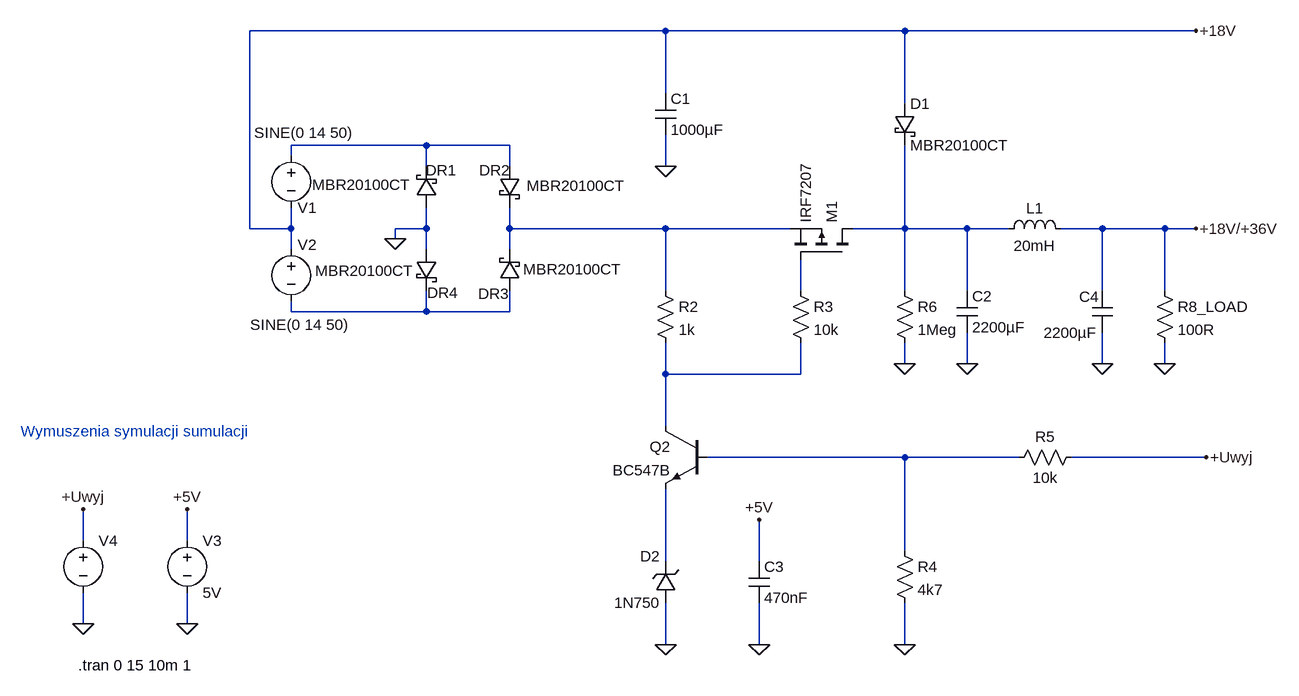
[diagram p0: schematic Base_On_SN1500-APO.asc]
Base_On_SN1500-APO.asc, the LTspice schematic file:
Version 4
SHEET 1 2132 1104
WIRE 768 -112 128 -112
WIRE 1136 -112 768 -112
WIRE 1584 -112 1136 -112
WIRE 768 -16 768 -112
WIRE 1136 0 1136 -112
WIRE 400 64 192 64
WIRE 528 64 400 64
WIRE 192 80 192 64
WIRE 400 96 400 64
WIRE 528 96 528 64
WIRE 768 96 768 48
WIRE 128 192 128 -112
WIRE 192 192 192 160
WIRE 192 192 128 192
WIRE 400 192 400 160
WIRE 400 192 352 192
WIRE 528 192 528 160
WIRE 768 192 528 192
WIRE 960 192 768 192
WIRE 1136 192 1136 64
WIRE 1136 192 1056 192
WIRE 1232 192 1136 192
WIRE 1296 192 1232 192
WIRE 1440 192 1376 192
WIRE 1536 192 1440 192
WIRE 1584 192 1536 192
WIRE 352 208 352 192
WIRE 192 224 192 192
WIRE 400 224 400 192
WIRE 528 224 528 192
WIRE 768 288 768 192
WIRE 976 288 976 240
WIRE 1136 288 1136 192
WIRE 1232 288 1232 192
WIRE 1440 288 1440 192
WIRE 1536 288 1536 192
WIRE 192 320 192 304
WIRE 400 320 400 288
WIRE 400 320 192 320
WIRE 528 320 528 288
WIRE 528 320 400 320
WIRE 1136 400 1136 368
WIRE 1232 400 1232 352
WIRE 1440 400 1440 352
WIRE 1536 400 1536 368
WIRE 768 416 768 368
WIRE 976 416 976 368
WIRE 976 416 768 416
WIRE 768 496 768 416
WIRE 1136 544 832 544
WIRE 1312 544 1136 544
WIRE 1600 544 1392 544
WIRE -128 672 -128 624
WIRE 32 672 32 624
WIRE 1136 688 1136 544
WIRE 768 704 768 592
WIRE 912 704 912 640
WIRE -128 800 -128 752
WIRE 32 800 32 752
WIRE 768 832 768 768
WIRE 912 832 912 768
WIRE 1136 832 1136 768
FLAG 352 208 0
FLAG 768 96 0
FLAG 1584 -112 +18V
FLAG 1136 832 0
FLAG 912 832 0
FLAG 1584 192 +18V/+36V
FLAG 1600 544 +Uwyj
FLAG 1232 400 0
FLAG 32 800 0
FLAG 32 624 +5V
FLAG -128 800 0
FLAG -128 624 +Uwyj
FLAG 1536 400 0
FLAG 1440 400 0
FLAG 768 832 0
FLAG 912 640 +5V
FLAG 1136 400 0
SYMBOL schottky 416 160 R180
WINDOW 0 -31 58 Left 0
WINDOW 3 39 35 Left 0
SYMATTR InstName DR1
SYMATTR Value MBR20100CT
SYMATTR Description Diode
SYMATTR Type diode
SYMBOL schottky 512 96 R0
WINDOW 0 -31 6 Left 0
WINDOW 3 42 30 Left 0
SYMATTR InstName DR2
SYMATTR Value MBR20100CT
SYMATTR Description Diode
SYMATTR Type diode
SYMBOL schottky 544 288 R180
WINDOW 0 16 -4 Left 0
WINDOW 3 -158 33 Left 0
SYMATTR InstName DR3
SYMATTR Value MBR20100CT
SYMATTR Description Diode
SYMATTR Type diode
SYMBOL schottky 384 224 R0
WINDOW 0 17 67 Left 0
WINDOW 3 -155 33 Left 0
SYMATTR InstName DR4
SYMATTR Value MBR20100CT
SYMATTR Description Diode
SYMATTR Type diode
SYMBOL voltage 192 64 R0
WINDOW 0 10 96 Left 0
WINDOW 3 -57 -19 Left 0
WINDOW 123 0 0 Left 0
WINDOW 39 0 0 Left 0
SYMATTR InstName V1
SYMATTR Value SINE(0 14 50)
SYMBOL voltage 192 208 R0
WINDOW 0 10 9 Left 0
WINDOW 3 -63 132 Left 0
WINDOW 123 0 0 Left 0
WINDOW 39 0 0 Left 0
SYMATTR InstName V2
SYMATTR Value SINE(0 14 50)
SYMBOL cap 752 -16 R0
SYMATTR InstName C1
SYMATTR Value 1000µF
SYMBOL schottky 1120 0 R0
SYMATTR InstName D1
SYMATTR Value MBR20100CT
SYMATTR Description Diode
SYMATTR Type diode
SYMBOL npn 832 496 M0
SYMATTR InstName Q2
SYMATTR Value BC547B
SYMBOL res 752 272 R0
SYMATTR InstName R2
SYMATTR Value 1k
SYMBOL res 960 272 R0
SYMATTR InstName R3
SYMATTR Value 10k
SYMBOL pmos 1056 240 M270
SYMATTR InstName M1
SYMATTR Value IRF7207
SYMBOL res 1120 272 R0
SYMATTR InstName R6
SYMATTR Value 1Meg
SYMBOL res 1120 672 R0
SYMATTR InstName R4
SYMATTR Value 4k7
SYMBOL cap 896 704 R0
SYMATTR InstName C3
SYMATTR Value 470nF
SYMBOL res 1408 528 R90
WINDOW 0 0 56 VBottom 0
WINDOW 3 32 56 VTop 0
SYMATTR InstName R5
SYMATTR Value 10k
SYMBOL cap 1216 288 R0
SYMATTR InstName C2
SYMATTR Value 2200µF
SYMBOL voltage 32 656 R0
WINDOW 123 0 0 Left 0
WINDOW 39 0 0 Left 0
SYMATTR InstName V3
SYMATTR Value 5V
SYMBOL voltage -128 656 R0
WINDOW 123 0 0 Left 0
WINDOW 39 0 0 Left 0
WINDOW 3 24 104 Invisible 0
SYMATTR Value PWL(1 14 2 15 3 16 4 17 5 18 6 19 7 20 8 19 9 18 10 17 11 16 12 15 13 14 14 13)
SYMATTR InstName V4
SYMBOL res 1520 272 R0
SYMATTR InstName R8_LOAD
SYMATTR Value 100R
SYMBOL ind 1280 208 R270
WINDOW 0 32 56 VTop 0
WINDOW 3 5 56 VBottom 0
SYMATTR InstName L1
SYMATTR Value 20mH
SYMBOL cap 1424 288 R0
WINDOW 0 -20 9 Left 0
WINDOW 3 -74 64 Left 0
SYMATTR InstName C4
SYMATTR Value 2200µF
SYMBOL zener 784 768 R180
WINDOW 0 24 72 Left 0
WINDOW 3 24 0 Left 0
SYMATTR InstName D2
SYMATTR Value 1N750
SYMATTR Description Diode
SYMATTR Type diode
TEXT -136 864 Left 0 !.tran 0 15 10m 1
TEXT -224 504 Left 0 ;Wymuszenia symulacji sumulacji

The netlist it stands for:
* Base_On_SN1500-APO.asc
DR1 0 N001 MBR20100CT
DR2 N001 N002 MBR20100CT
DR3 N005 N002 MBR20100CT
DR4 0 N005 MBR20100CT
V1 N001 +18V SINE(0 14 50)
V2 +18V N005 SINE(0 14 50)
C1 +18V 0 1000µF
D1 +18V N003 MBR20100CT
Q2 N006 N007 N008 0 BC547B
R2 N002 N006 1k
R3 N004 N006 10k
M1 N003 N004 N002 N002 IRF7207
R6 N003 0 1Meg
R4 N007 0 4k7
C3 +5V 0 470nF
R5 +Uwyj N007 10k
C2 N003 0 2200µF
V3 +5V 0 5V
V4 +Uwyj 0 PWL(1 14 2 15 3 16 4 17 5 18 6 19 7 20 8 19 9 18 10 17 11 16 12 15 13 14 14 13)
R8_LOAD +18V/+36V 0 100R
L1 N003 +18V/+36V 20mH
C4 +18V/+36V 0 2200µF
D2 0 N008 1N750
.model D D
.lib standard.dio
.model NPN NPN
.model PNP PNP
.lib standard.bjt
.model NMOS NMOS
.model PMOS PMOS
.lib standard.mos
.tran 0 15 10m 1
* Wymuszenia symulacji sumulacji
.backanno
.end